# EAGLE design board (EAGLE 9.0.0)
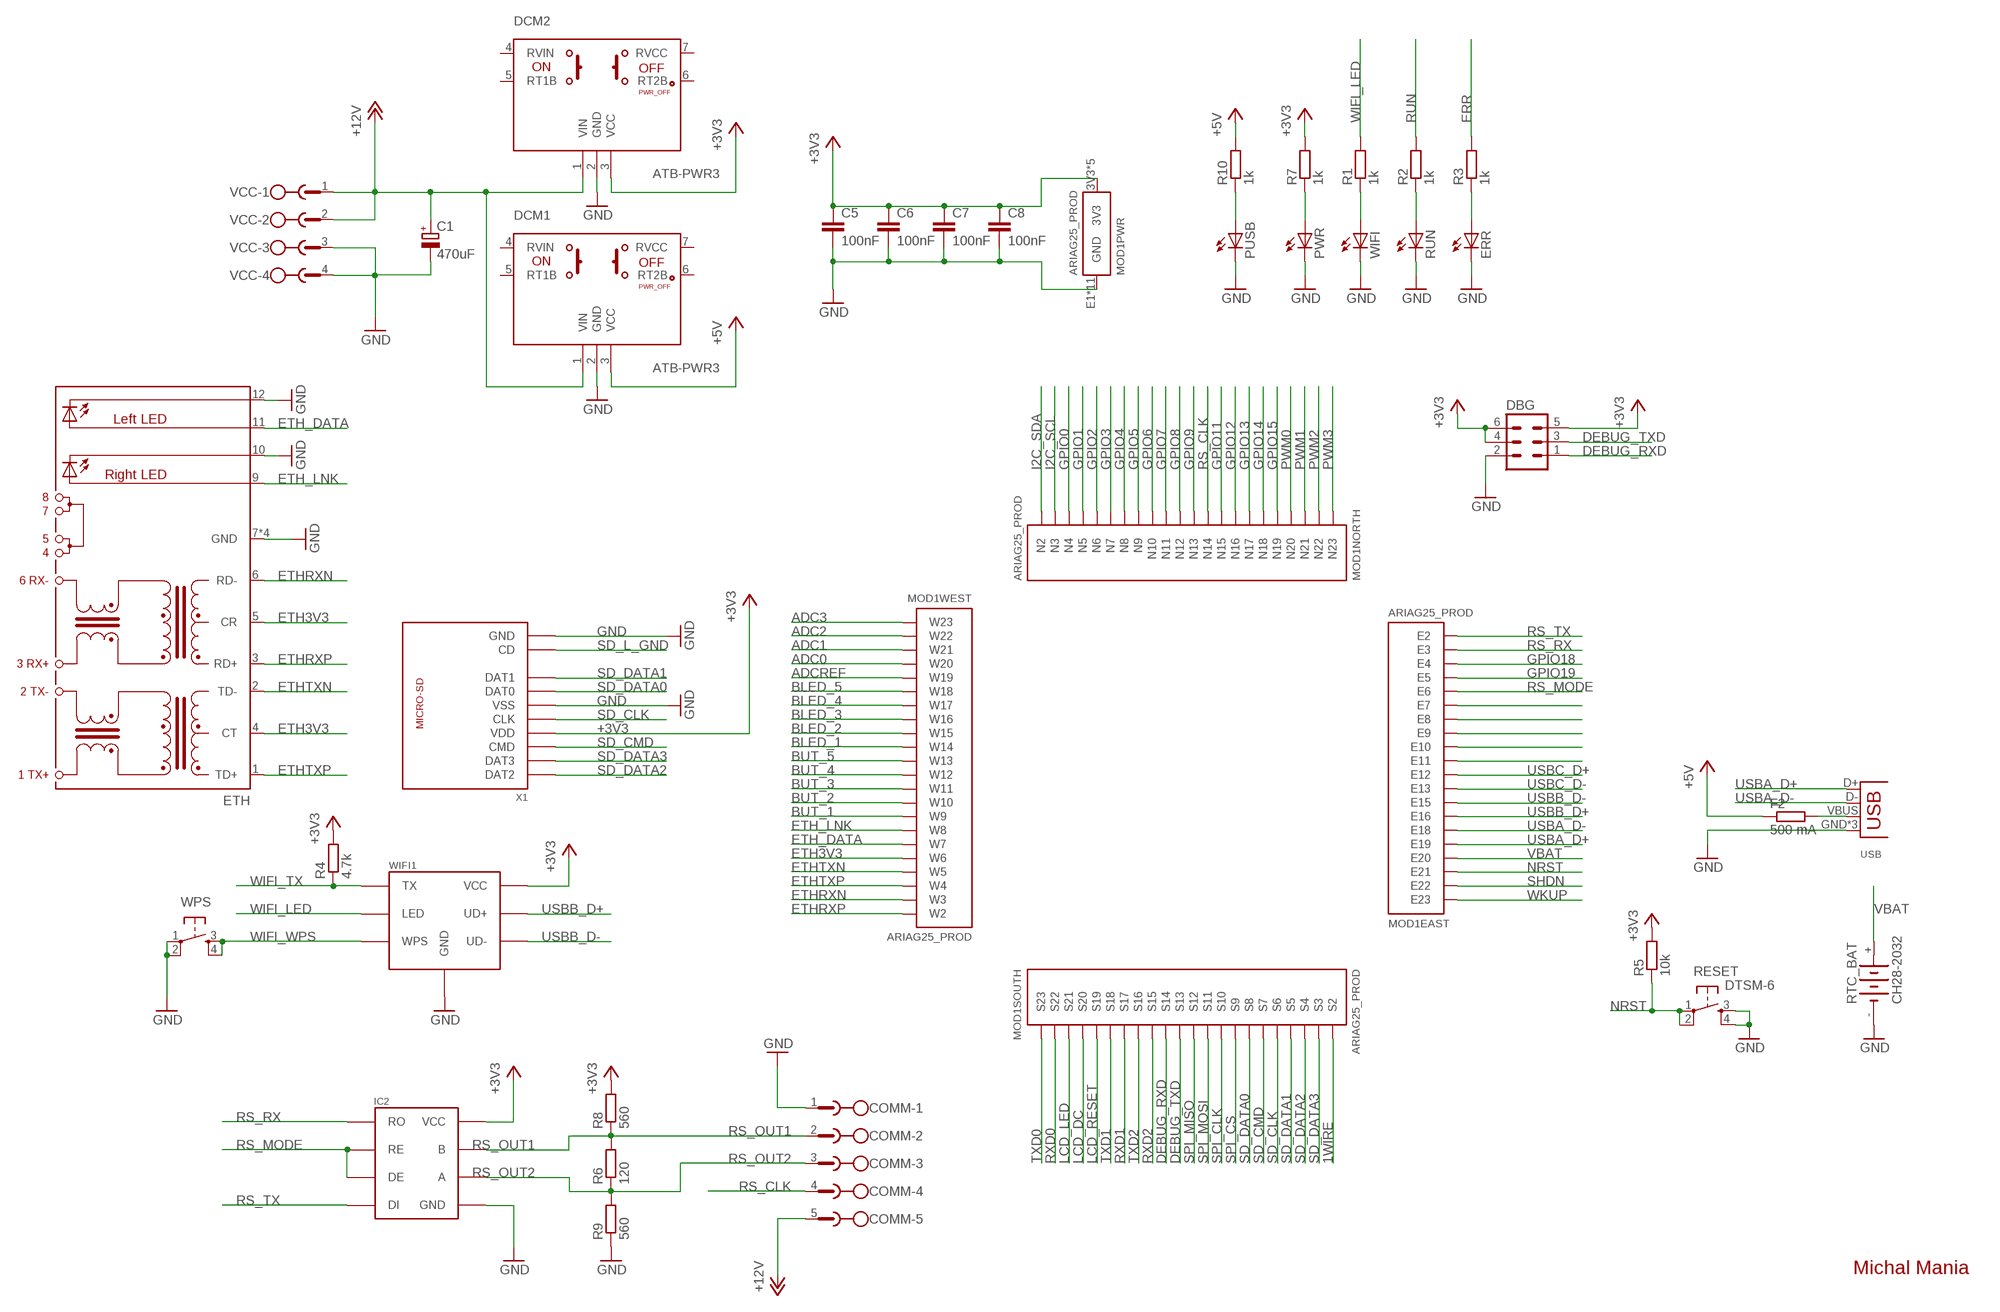
[diagram p0: schematic, sheet 1]

## Parts
C1  470uF  CPOL-EUG  [PANASONIC_G]
C5  100nF  C-EUC0805  [C0805]
C6  100nF  C-EUC0805  [C0805]
C7  100nF  C-EUC0805  [C0805]
C8  100nF  C-EUC0805  [C0805]
COMM  MSTBV5  [MSTBV5]
DBG  MA03-2  [MA03-2]
DCM1  ATB-PWR3  [ATB-PWR3]
DCM2  ATB-PWR3  [ATB-PWR3]
ERR  LEDSML0805  [SML0805]
ETH  J21388  [J1_3_TOP]
F2  500 mA  R-EU_R0805  [R0805]
IC2  MAX3485  [SO-8]
MOD1  ARIAG25_PROD  [G25_D]
PUSB  LEDSML0805  [SML0805]
PWR  LEDSML0805  [SML0805]
R1  1k  R-EU_R0805  [R0805]
R2  1k  R-EU_R0805  [R0805]
R3  1k  R-EU_R0805  [R0805]
R4  4.7k  R-EU_R0805  [R0805]
R5  10k  R-EU_R0805  [R0805]
R6  120  R-EU_R0805  [R0805]
R7  1k  R-EU_R0805  [R0805]
R8  560  R-EU_R0805  [R0805]
R9  560  R-EU_R0805  [R0805]
R10  1k  R-EU_R0805  [R0805]
RESET  DTSM-6  [DTSM-6]
RTC_BAT  CH28-2032  [CH28-2032]
RUN  LEDSML0805  [SML0805]
USB  USBA-P  [USB-A-P]
VCC  MSTBV4  [MSTBV4]
WIFI  LEDSML0805  [SML0805]
WIFI1  WIFI-2-OEM  [WIFI]
WPS  DTSM-6  [DTSM-6]
X1  MICRO-SD  [112I-TDAR-R]

## Nets
1WIRE: MOD1.S2(SOUTH:S2)
+3V3: C5.1 C6.1 C7.1 C8.1 DBG.4 DBG.5 DBG.6 DCM2.3(VCC) IC2.VCC MOD1.3V3(PWR:3V3) MOD1.E24(PWR:3V3) MOD1.N1(PWR:3V3) MOD1.S1(PWR:3V3) MOD1.W24(PWR:3V3) R4.2 R5.2 R7.2 R8.2 WIFI1.VCC X1.4(VDD)
+5V: DCM1.3(VCC) F2.1 R10.2
+12V: C1.+ COMM.5 DCM1.1(VIN) DCM2.1(VIN) VCC.1 VCC.2
ADC0: MOD1.W20(WEST:W20)
ADC1: MOD1.W21(WEST:W21)
ADC2: MOD1.W22(WEST:W22)
ADC3: MOD1.W23(WEST:W23)
ADCREF: MOD1.W19(WEST:W19)
BLED_1: MOD1.W14(WEST:W14)
BLED_2: MOD1.W15(WEST:W15)
BLED_3: MOD1.W16(WEST:W16)
BLED_4: MOD1.W17(WEST:W17)
BLED_5: MOD1.W18(WEST:W18)
BUT_1: MOD1.W9(WEST:W9)
BUT_2: MOD1.W10(WEST:W10)
BUT_3: MOD1.W11(WEST:W11)
BUT_4: MOD1.W12(WEST:W12)
BUT_5: MOD1.W13(WEST:W13)
DEBUG_RXD: DBG.1 MOD1.S14(SOUTH:S14)
DEBUG_TXD: DBG.3 MOD1.S13(SOUTH:S13)
ERR: R3.2
ETH3V3: ETH.4(CT) ETH.5(CR) MOD1.W6(WEST:W6)
ETH_DATA: ETH.11(L+) MOD1.W7(WEST:W7)
ETH_LNK: ETH.9(R+) MOD1.W8(WEST:W8)
ETHRXN: ETH.6(RD-) MOD1.W3(WEST:W3)
ETHRXP: ETH.3(RD+) MOD1.W2(WEST:W2)
ETHTXN: ETH.2(TD-) MOD1.W5(WEST:W5)
ETHTXP: ETH.1(TD+) MOD1.W4(WEST:W4)
GND: C1.- C5.2 C6.2 C7.2 C8.2 COMM.1 DBG.2 DCM1.2(GND) DCM2.2(GND) ERR.C ETH.7(GND) ETH.8(GND) ETH.10(R-) ETH.12(L-) ETH.M1(GND) ETH.M2(GND) IC2.GND MOD1.E1(PWR:GND) MOD1.E14(PWR:GND) MOD1.E17(PWR:GND) MOD1.GND@1(PWR:GND) MOD1.GND@2(PWR:GND) MOD1.GND@3(PWR:GND) MOD1.GND@4(PWR:GND) MOD1.GND@5(PWR:GND) MOD1.N24(PWR:GND) MOD1.S24(PWR:GND) MOD1.W1(PWR:GND) PUSB.C PWR.C R9.1 RESET.3 RESET.4 RTC_BAT.- RUN.C USB.GND USB.P$5(GND) USB.P$6(GND) VCC.3 VCC.4 WIFI1.GND WIFI.C WPS.1 WPS.2 X1.6(VSS) X1.GND_A(GND) X1.GND_B(GND) X1.GND_C(GND)
GPIO0: MOD1.N4(NORTH:N4)
GPIO1: MOD1.N5(NORTH:N5)
GPIO2: MOD1.N6(NORTH:N6)
GPIO3: MOD1.N7(NORTH:N7)
GPIO4: MOD1.N8(NORTH:N8)
GPIO5: MOD1.N9(NORTH:N9)
GPIO6: MOD1.N10(NORTH:N10)
GPIO7: MOD1.N11(NORTH:N11)
GPIO8: MOD1.N12(NORTH:N12)
GPIO9: MOD1.N13(NORTH:N13)
GPIO11: MOD1.N15(NORTH:N15)
GPIO12: MOD1.N16(NORTH:N16)
GPIO13: MOD1.N17(NORTH:N17)
GPIO14: MOD1.N18(NORTH:N18)
GPIO15: MOD1.N19(NORTH:N19)
GPIO18: MOD1.E4(EAST:E4)
GPIO19: MOD1.E5(EAST:E5)
I2C_SCL: MOD1.N3(NORTH:N3)
I2C_SDA: MOD1.N2(NORTH:N2)
LCD_DC: MOD1.S20(SOUTH:S20)
LCD_LED: MOD1.S21(SOUTH:S21)
LCD_RESET: MOD1.S19(SOUTH:S19)
N$1: R1.1 WIFI.A
N$2: F2.2 USB.VBUS
N$3: MOD1.E11(EAST:E11)
N$5: R2.1 RUN.A
N$6: ERR.A R3.1
N$7: PWR.A R7.1
N$8: PUSB.A R10.1
N$11: MOD1.E7(EAST:E7)
N$12: MOD1.E8(EAST:E8)
N$13: MOD1.E9(EAST:E9)
N$14: MOD1.E10(EAST:E10)
NRST: MOD1.E21(EAST:E21) R5.1 RESET.1 RESET.2
PWM0: MOD1.N20(NORTH:N20)
PWM1: MOD1.N21(NORTH:N21)
PWM2: MOD1.N22(NORTH:N22)
PWM3: MOD1.N23(NORTH:N23)
RS_CLK: COMM.4 MOD1.N14(NORTH:N14)
RS_MODE: IC2.DE IC2.RE MOD1.E6(EAST:E6)
RS_OUT1: COMM.2 IC2.B R6.2 R8.1
RS_OUT2: COMM.3 IC2.A R6.1 R9.2
RS_RX: IC2.RO MOD1.E3(EAST:E3)
RS_TX: IC2.DI MOD1.E2(EAST:E2)
RUN: R2.2
RXD0: MOD1.S22(SOUTH:S22)
RXD1: MOD1.S17(SOUTH:S17)
RXD2: MOD1.S15(SOUTH:S15)
SD_CLK: MOD1.S6(SOUTH:S6) X1.5(CLK)
SD_CMD: MOD1.S7(SOUTH:S7) X1.3(CMD)
SD_DATA0: MOD1.S8(SOUTH:S8) X1.7(DAT0)
SD_DATA1: MOD1.S5(SOUTH:S5) X1.8(DAT1)
SD_DATA2: MOD1.S4(SOUTH:S4) X1.1(DAT2)
SD_DATA3: MOD1.S3(SOUTH:S3) X1.2(DAT3)
SD_L_GND: X1.CD
SHDN: MOD1.E22(EAST:E22)
SPI_CLK: MOD1.S10(SOUTH:S10)
SPI_CS: MOD1.S9(SOUTH:S9)
SPI_MISO: MOD1.S12(SOUTH:S12)
SPI_MOSI: MOD1.S11(SOUTH:S11)
TXD0: MOD1.S23(SOUTH:S23)
TXD1: MOD1.S18(SOUTH:S18)
TXD2: MOD1.S16(SOUTH:S16)
USBA_D+: MOD1.E19(EAST:E19) USB.D+
USBA_D-: MOD1.E18(EAST:E18) USB.D-
USBB_D+: MOD1.E16(EAST:E16) WIFI1.UD+
USBB_D-: MOD1.E15(EAST:E15) WIFI1.UD-
USBC_D+: MOD1.E12(EAST:E12)
USBC_D-: MOD1.E13(EAST:E13)
VBAT: MOD1.E20(EAST:E20) RTC_BAT.+
WIFI_LED: R1.2 WIFI1.LED
WIFI_TX: R4.1 WIFI1.TX
WIFI_WPS: WIFI1.WPS WPS.3 WPS.4
WKUP: MOD1.E23(EAST:E23)
Unconnected: DCM1.4(RVIN) DCM1.5(RT1B) DCM1.6(RT2B) DCM1.7(RVCC) DCM2.4(RVIN) DCM2.5(RT1B) DCM2.6(RT2B) DCM2.7(RVCC)

## Notes on the sheet
- Michal Mania

## Library data of the parts
C1 = rcl:CPOL-EU: POLARIZED CAPACITOR, European symbol
C5-C8 = rcl:C-EU: CAPACITOR, European symbol
COMM = con-phoenix-508:MSTBV5: PHOENIX; MPN: MSTBV 2,5/5-GF-5.08; OC_FARNELL: 1792795; OC_NEWARK: 69R9848
DBG = con-lstb:MA03-2: PIN HEADER; OC_FARNELL: unknown; OC_NEWARK: unknown
DCM1 DCM2 = _ATNEL:ATB-PWR3
ERR PUSB PWR RUN WIFI = led:LED: LED OSRAM: - CHIPLED LG R971, LG N971, LY N971, LG Q971, LY Q971, LO R971, LY R971 LH N974, LH R974 LS Q976, LO Q976, LY Q976 LO Q996 - Hyper CHIPLED LW Q18S LB Q993, LB Q99A, LB R99A - SideLED LS A670, LO A670, LY A670, LG A670, LP A670 LB A673, LV A673, LT A673, LW A673 LH A674 LY A675 LS A676, LA A676, LO A676, LY A676, LW A676 LS A679, LY A679, LG A679 - Hyper Micro SIDELED® LS Y876, LA Y876, LO Y876, LY Y876 LT Y87S - SmartLED LW L88C, LW L88S LB L89C, LB L89S, LG L890 LS L89K, LO L89K, LY L89K LS L896, LA L896, LO L896, LY L896 - TOPLED LS T670, LO T670, LY T670, LG T670, LP T670 LSG T670, LSP T670, LSY T670, LOP T670, LYG T670 LG T671, LOG T671, LSG T671 LB T673, LV T673, LT T673, LW T673 LH T674 LS T676, LA T676, LO T676, LY T676, LB T676, LH T676, LSB T676, LW T676 LB T67C, LV T67C, LT T67C, LS T67K, LO T67K, LY T67K, LW E67C LS E67B, LA E67B, LO E67B, LY E67B, LB E67C, LV E67C, LT E67C LW T67C LS T679, LY T679, LG T679 LS T770, LO T770, LY T770, LG T770, LP T770 LB T773, LV T773, LT T773, LW T773 LH T774 LS E675, LA E675, LY E675, LS T675 LS T776, LA T776, LO T776, LY T776, LB T776 LHGB T686 LT T68C, LB T68C - Hyper Mini TOPLED® LB M676 - Mini TOPLED Santana® LG M470 LS M47K, LO M47K, LY M47K Source: http://www.osram.convergy.de LUXEON: - LUMILED® LXK2-PW12-R00, LXK2-PW12-S00, LXK2-PW14-U00, LXK2-PW14-V00 LXK2-PM12-R00, LXK2-PM12-S00, LXK2-PM14-U00 LXK2-PE12-Q00, LXK2-PE12-R00, LXK2-PE12-S00, LXK2-PE14-T00, LXK2-PE14-U00 LXK2-PB12-K00, LXK2-PB12-L00, LXK2-PB12-M00, LXK2-PB14-N00, LXK2-PB14-P00, LXK2-PB14-Q00 LXK2-PR12-L00, LXK2-PR12-M00, LXK2-PR14-Q00, LXK2-PR14-R00 LXK2-PD12-Q00, LXK2-PD12-R00, LXK2-PD12-S00 LXK2-PH12-R00, LXK2-PH12-S00 LXK2-PL12-P00, LXK2-PL12-Q00, LXK2-PL12-R00 Source: www.luxeon.com KINGBRIGHT: KA-3528ASYC Source: www.kingbright.com
ETH = con-pulse:J21388
F2 R1-R10 = resistor:R-EU_: RESISTOR, European symbol
IC2 = MAX3485ESA:MAX3485
MOD1 = ariag25_pelicella:ARIAG25_PROD: Aria G25 - Low cost Linux Embedded SMD module ISTRUZIONI PER IL MONTAGGIO Per il telaio serigrafico lo spessore è 120 micron così si possono montare componenti anche piccoli come gli 0402 vicino all'Aria. Per il montaggio automatico delle Aria: Additional Z move durante il piazzamento: 0.5mm (utile per spingere l'Aria sulla carrier in modo che si adatti a tocchi tutte le PAD con lo stagno. (l'additional Z move infatti è assorbito dalle molle della testa automatica) Tempo di piazzamento: 5 seconds (necessario per permettere all'Aria di toccare perfettamente tutte le PAD stagnate) Altezza Z dell'Aria: 2.7mm Montare le Aria a bassa velocità totale.
RESET WPS = switch-tact:DTSM-6
RTC_BAT = battery:CH28-2032
USB = con-usb-3:USB: USB Connectors
VCC = con-phoenix-508:MSTBV4: PHOENIX; MPN: MSTBV 2,5/4-GF-5.08; OC_FARNELL: 1792794; OC_NEWARK: 69R9847
WIFI1 = WIFI-2-OEM:WIFI-2-OEM
X1 = con-attend:MICRO-SD

## Board
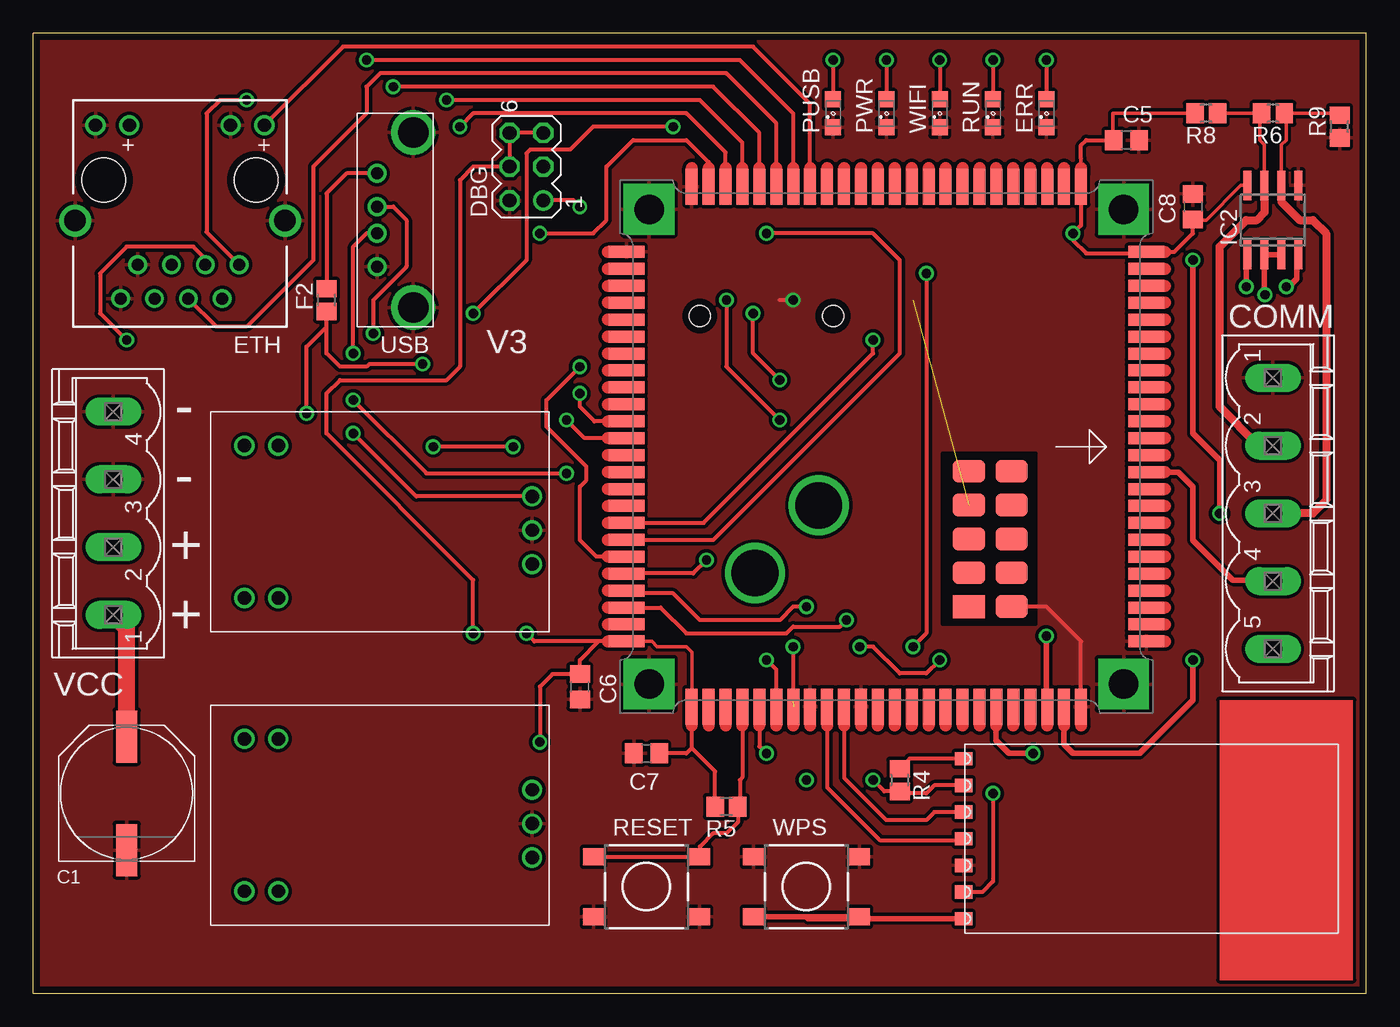
[diagram p1: board, top side]
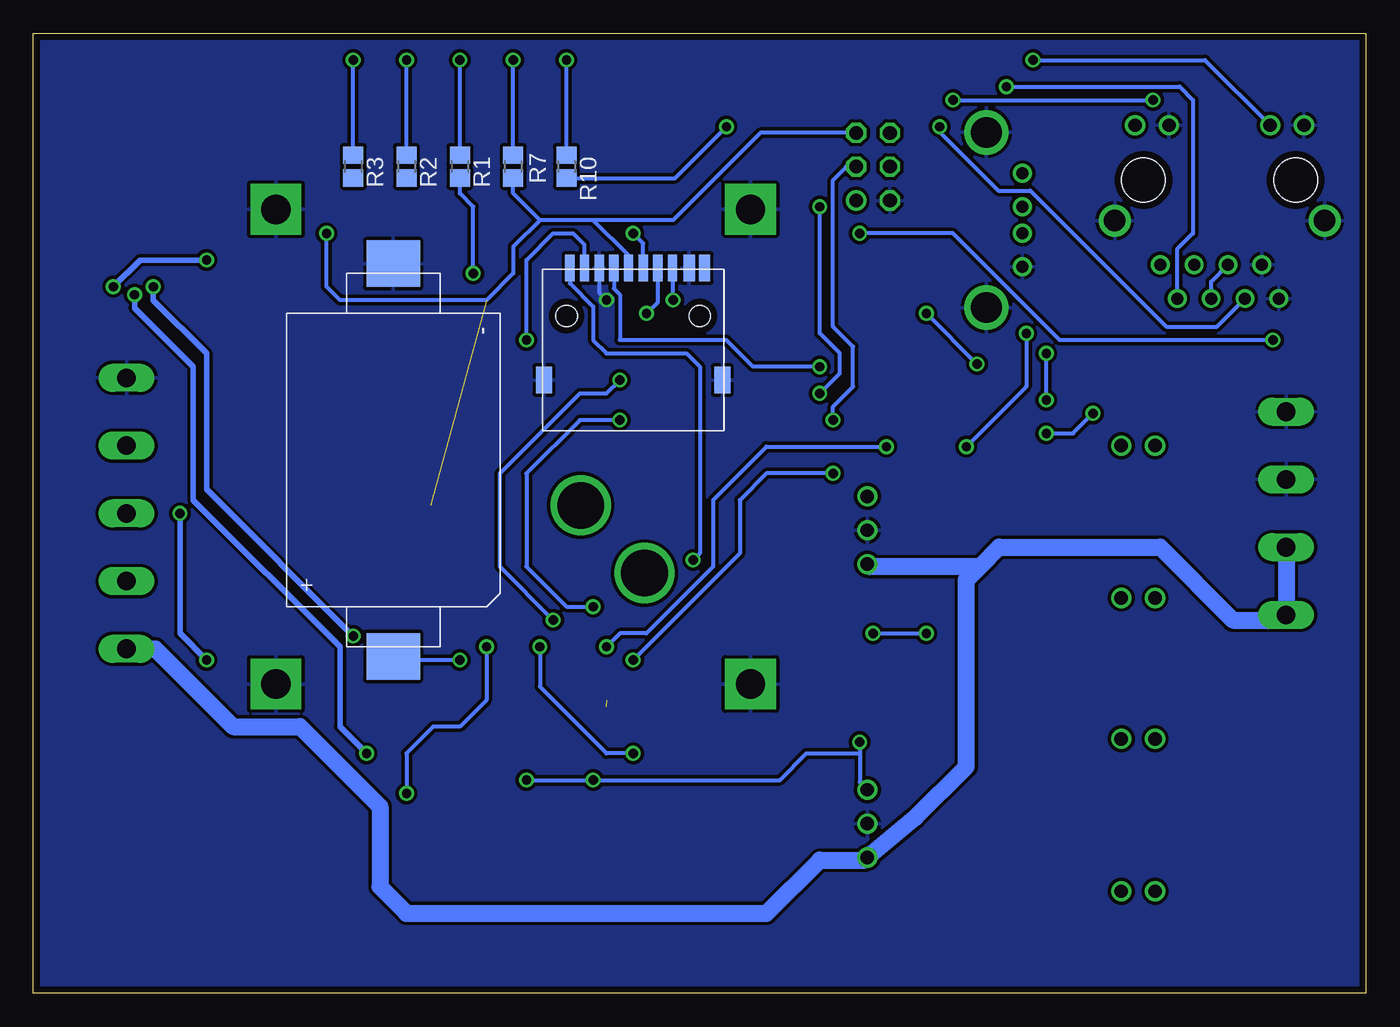
[diagram p2: board, bottom side, seen from below]

Size 100 x 72 mm. Coordinates in mm from the lower left corner, seen from the top.
Outline: 0,0 100,0 100,72 0,72 0,0
Copper layers (1*16): Top 0.035mm / dielectric 1.5mm / Bottom 0.035mm
Design rules "default *": minimum track width 10mil, minimum drill 24mil, track to track 10mil, track to pad 10mil, pad to pad 10mil, via to via 10mil, smd to smd 10mil, copper to edge 20mil, drill to drill 10mil, minimum pad ring 10mil, minimum via ring 8mil, stop-mask expansion 4mil, vias tented up to drill 0mil, thermal gap 10mil
tKeepout: area 0,69 to 100,72; area 0,0 to 100,3
bKeepout: area 0,66 to 100,72; area 0,0 to 100,6

### Footprints (pad centres in the part's own frame; a part is rotated, then mirrored left to right if it is on the bottom)
PANASONIC_G = smd 3.9 x 1.6: + 4.25,0; - -4.25,0
C0805 = smd 1.3 x 1.5: 1 -0.95,0; 2 0.95,0
MSTBV5 = drill 1.397 long: 1 -10.16,0; 2 -5.08,0; 3 0,0; 4 5.08,0; 5 10.16,0
MA03-2 = drill 1.016: 1 -2.54,-1.27 | drill 1.016 octagon: 2 -2.54,1.27; 3 0,-1.27; 4 0,1.27; 5 2.54,-1.27; 6 2.54,1.27
ATB-PWR3 = drill 1: 1 11.43,-3.81; 2 11.43,-1.27; 3 11.43,1.27; 4 -7.62,-6.35; 5 -10.16,-6.35; 6 -10.16,5.08; 7 -7.62,5.08
SML0805 = smd 1.2 x 1.2: A 1.05,0; C -1.05,0
J1_3_TOP = drill 0.9 pad 1.3: 1 4.445,-4.35; 2 3.175,-6.89; 3 1.905,-4.35; 4 0.635,-6.89; 5 -0.635,-4.35; 6 -1.905,-6.89; 7 -3.175,-4.35; 8 -4.445,-6.89 | drill 1 pad 1.422: 9 6.335,6.11; 10 3.795,6.11; 11 -3.795,6.11; 12 -6.335,6.11 | drill 1.6 pad 2.184: M1 7.875,-1.05; M2 -7.875,-1.05 | hole 3.3: -5.715,2; 5.715,2
R0805 = smd 1.3 x 1.5: 1 -0.85,0; 2 0.85,0
SO-8 = smd 2.2 x 0.6: A 2.6,-0.635; B 2.6,0.635; DE -2.6,-0.635; DI -2.6,-1.905; GND 2.6,-1.905; RE -2.6,0.635; RO -2.6,1.905; VCC 2.6,1.905
G25_D = smd 1.7 x 2.4: 3V3 4.38,6.2; GND@5 12,9.4; P$2 9.46,9.4; P$3 6.92,9.4; P$4 4.38,9.4; P$5 1.84,9.4; P$6 12,6.2; P$7 9.46,6.2; P$8 6.92,6.2; P$10 1.84,6.2 | smd 2.7 x 0.9: E1 19.5,14.605; E2 19.5,13.335; E3 19.5,12.065; E4 19.5,10.795; E5 19.5,9.525; E6 19.5,8.255; E7 19.5,6.985; E8 19.5,5.715; E9 19.5,4.445; E10 19.5,3.175; E11 19.5,1.905; E12 19.5,0.635; E13 19.5,-0.635; E14 19.5,-1.905; E15 19.5,-3.175; E16 19.5,-4.445; E17 19.5,-5.715; E18 19.5,-6.985; E19 19.5,-8.255; E20 19.5,-9.525; E21 19.5,-10.795; E22 19.5,-12.065; E23 19.5,-13.335; E24 19.5,-14.605; W1 -19.5,-14.605; W2 -19.5,-13.335; W3 -19.5,-12.065; W4 -19.5,-10.795; W5 -19.5,-9.525; W6 -19.5,-8.255; W7 -19.5,-6.985; W8 -19.5,-5.715; W9 -19.5,-4.445; W10 -19.5,-3.175; W11 -19.5,-1.905; W12 -19.5,-0.635; W13 -19.5,0.635; W14 -19.5,1.905; W15 -19.5,3.175; W16 -19.5,4.445; W17 -19.5,5.715; W18 -19.5,6.985; W19 -19.5,8.255; W20 -19.5,9.525; W21 -19.5,10.795; W22 -19.5,12.065; W23 -19.5,13.335; W24 -19.5,14.605 | drill 2.2 pad 3.81 square: GND@1 -17.8,17.8; GND@2 17.8,17.8; GND@3 17.8,-17.8; GND@4 -17.8,-17.8 | smd 0.9 x 2.7: N1 -14.605,19.5; N2 -13.335,19.5; N3 -12.065,19.5; N4 -10.795,19.5; N5 -9.525,19.5; N6 -8.255,19.5; N7 -6.985,19.5; N8 -5.715,19.5; N9 -4.445,19.5; N10 -3.175,19.5; N11 -1.905,19.5; N12 -0.635,19.5; N13 0.635,19.5; N14 1.905,19.5; N15 3.175,19.5; N16 4.445,19.5; N17 5.715,19.5; N18 6.985,19.5; N19 8.255,19.5; N20 9.525,19.5; N21 10.795,19.5; N22 12.065,19.5; N23 13.335,19.5; N24 14.605,19.5; S1 14.605,-19.5; S2 13.335,-19.5; S3 12.065,-19.5; S4 10.795,-19.5; S5 9.525,-19.5; S6 8.255,-19.5; S7 6.985,-19.5; S8 5.715,-19.5; S9 4.445,-19.5; S10 3.175,-19.5; S11 1.905,-19.5; S12 0.635,-19.5; S13 -0.635,-19.5; S14 -1.905,-19.5; S15 -3.175,-19.5; S16 -4.445,-19.5; S17 -5.715,-19.5; S18 -6.985,-19.5; S19 -8.255,-19.5; S20 -9.525,-19.5; S21 -10.795,-19.5; S22 -12.065,-19.5; S23 -13.335,-19.5; S24 -14.605,-19.5 | drill 3.5 pad 3.8: P$15 9.48,-9.86; P$16 4.4,-5.07
DTSM-6 = smd 1.55 x 1.3: 1 -3.975,2.25; 2 3.975,2.25; 3 -3.975,-2.25; 4 3.975,-2.25
CH28-2032 = smd 3.5 x 4: + 14.73,0; - -14.73,0
USB-A-P = drill 0.9: D+ -1,4.21; D- 1,4.21; GND -3.5,4.21; VBUS 3.5,4.21 | drill 2.3: P$5 -6.57,1.5; P$6 6.57,1.5
MSTBV4 = drill 1.397 long: 1 -7.62,0; 2 -2.54,0; 3 2.54,0; 4 7.62,0
WIFI = smd 1.3 x 1: GND -14.2,-2.4; LED -14.2,-4.4; TX -14.2,5.6; UD+ -14.2,-0.4; UD- -14.2,1.6; VCC -14.2,3.6; WPS -14.2,-6.4
112I-TDAR-R = smd 0.7 x 2: 1 2.95,3.4; 2 1.85,3.4; 3 0.75,3.4; 4 -0.35,3.4; 5 -1.45,3.4; 6 -2.55,3.4; 7 -3.65,3.4; 8 -4.75,3.4 | smd 0.85 x 2: CD 5.35,3.4; GND_C 4.2,3.4 | smd 1.2 x 2: GND_A -6.7,-5; GND_B 6.7,-5 | hole 1.6: -5,-0.2; 5,-0.2

### Placement (x,y rotation side)
C1  7,15 90 top
C5  82,64 0 top
C6  41,23 270 top
C7  46,18 180 top
C8  87,59 90 top
COMM  93,36 270 top
DBG  37,62 90 top
DCM1  26,36 0 top
DCM2  26,14 0 top
ERR  76,66 90 top
ETH  11,59 0 top
F2  22,52 90 top
IC2  93,58 90 top
MOD1  64,41 270 top
PUSB  60,66 90 top
PWR  64,66 90 top
R1  68,62 270 bottom
R2  72,62 270 bottom
R3  76,62 270 bottom
R4  65,16 270 top
R5  52,14 180 top
R6  93,66 180 top
R7  64,62 270 bottom
R8  88,66 180 top
R9  98,65 90 top
R10  60,62 270 bottom
RESET  46,8 0 top
RTC_BAT  73,40 270 bottom
RUN  72,66 90 top
USB  30,58 90 top
VCC  6,36 90 top
WIFI  68,66 90 top
WIFI1  84,12 0 top
WPS  58,8 0 top
X1  55,51 0 bottom

### Tracks (layer width: path | path; a pad name or v marks a point on that pad's centre or on a via)
+3V3  (via drill 0.7)  (1 unrouted)
  Top 0.254: MOD1.W24 78.61,62.6 | R8.2 81,66 81,64.05 C5.1 | IC2.VCC 90.6,60.6 88,58 87.05,58 C8.1 | 49,18 49.4,18.4 49.4,25.6 49,26 46.8,26 46.4,26.4 MOD1.S1
  Top 0.305: MOD1.E24 49.4,18.39 49,18 C7.1 | 42.4,26.39 41,25 C6.1 38.95,23.95 38,23 v38,18.84 | MOD1.S1 42.4,26.39 | C8.1 87,57 85.61,55.6 MOD1.N1 83.39,55.5 79,55.5 78,56.5 v78,57 78.61,57.6 MOD1.W24 | 78.61,62.6 78.61,63.6 79,64 C5.1 | DBG.5 DBG.6 DBG.4 33,62 32,61 32,47 31,46 23,46 22,45 22,42 33,31 v33,27 | 42.4,26.39 37.6,26.39 v37,27 | WIFI1.VCC 67.6,15.6 67,15 65.15,15 R4.2 63.85,15.15 v63,16 | R5.2 51.15,16.65 49.4,18.4
  Bottom 0.305: X1.4 55.35,55.35 58,58 | v37,27 v33,27 | v63,16 v58,16 44,16 42,18 38,18 | DBG.5 45.46,64.54 52,58 58,58 | 62,58 64,56 64,54 66,52 77,52 78,53 v78,57 | v38,18.84 38,18 | 38,18 38,15.84 DCM2.3 | 58,58 62,58 | 62,58 64,60 R7.2
+5V  (via drill 0.7)
  Top 0.305: DCM1.3 28.73,37.27 v24,42 | v20.5,43.5 20.5,48.5 22,50 | 22,50 F2.1 | v48,65 42,65 40.3,63.3 37.3,63.3 37,63 37,55 v33,51 | v29.2,47.2 25.2,47.2 25,47 23,47 22,48 22,50
  Bottom 0.305: v24,42 22,42 v20.5,43.5 | R10.2 51.85,61.15 v48,65 | v33,51 v29.2,47.2
+12V
  Top 1.27: C1.+ 7,27.38 VCC.1
  Bottom 1.27: 29,32 27.54,33.46 15.46,33.46 10,28 6.38,28 VCC.1 VCC.2 | 29,32 37.24,32 DCM1.1 | 29,32 30,31 30,17 33.81,13.19 DCM2.1 37.62,10 41,10 45,6 72,6 74,8 74,14 80,20 85,20 90.84,25.84 COMM.5
DEBUG_RXD  (via drill 0.7)
  Top 0.305: MOD1.S14 42.09,42.91 41,44 v41,45 | v41,59 40.5,59.5 38.31,59.5 DBG.1
  Bottom 0.305: v41,45 39.5,46.5 39.5,48 41,49.5 v41,59
DEBUG_TXD  (via drill 0.7)
  Top 0.305: MOD1.S13 41.37,41.63 v40,43
  Bottom 0.305: DBG.3 39,62 40,61 40,50 38.5,48.5 38.5,45.5 40,44 v40,43
ETH3V3
  Top 0.305: MOD1.W6 55.74,65.25 52,69 26,69 25,68 25,66 21,62 21,55 16,50 13.74,50 ETH.4
  Bottom 0.305: ETH.4 11.63,53.38 ETH.5
ETH_DATA  (via drill 0.7)
  Top 0.305: v25,70 53,70 57,66 57,60.52 MOD1.W7
  Bottom 0.305: v25,70 12.1,70 ETH.11
ETH_LNK
  Top 0.305: ETH.9 23.23,71 54,71 58.28,66.72 MOD1.W8
ETHRXN  (via drill 0.7)
  Top 0.305: MOD1.W3 51.94,63.06 49,66 33,66 v32,65
  Bottom 0.305: v32,65 32,64.6 27.6,60.2 25.2,60.2 15,50 11.21,50 ETH.6
ETHRXP  (via drill 0.7)
  Top 0.305: ETH.3 12.9,55.09 12,56 7,56 5,54 5,51 v7,49 | v38,57 42,57 43,58 43,62 45,64 49,64 50.66,62.34 MOD1.W2
  Bottom 0.305: v7,49 23,49 31,57 v38,57
ETHTXN  (via drill 0.7)
  Top 0.305: MOD1.W5 54.48,64.53 51,68 v27,68
  Bottom 0.305: v27,68 14,68 13,67 13,57 14.2,55.8 14.2,52.13 ETH.2
ETHTXP  (via drill 0.7)
  Top 0.305: MOD1.W4 53.2,63.8 50,67 v31,67 | v16,67 14,67 13,66 13,57.09 ETH.1
  Bottom 0.305: v31,67 v16,67
GND  (via drill 0.7)
  Top 0.305: MOD1.E1 78.61,26.39 76,29 MOD1.GND@5 | v57,52 56,52
  Bottom 0.305: X1.6 57.55,52.55 v57,52
  pour Top: 0,72 100,72 100,0 0,0
  pour Bottom: 0,72 100,72 100,0 0,0
N$1  (via drill 0.7)
  Top 0.305: v68,70 WIFI.A
  Bottom 0.305: R1.1 v68,70
N$2
  Top 0.305: USB.VBUS 23.5,61.5 22,60 F2.2
N$4
  cutout Top: 68.2,40.5 75.2,40.5 75.2,27.7 68.2,27.7
N$5  (via drill 0.7)
  Top 0.305: v72,70 RUN.A
  Bottom 0.305: R2.1 v72,70
N$6  (via drill 0.7)
  Top 0.305: v76,70 ERR.A
  Bottom 0.305: R3.1 v76,70
N$7  (via drill 0.7)
  Top 0.305: v64,70 PWR.A
  Bottom 0.305: R7.1 v64,70
N$8  (via drill 0.7)
  Top 0.305: v60,70 PUSB.A
  Bottom 0.305: R10.1 v60,70
NRST
  Top 0.305: RESET.1 RESET.2 50,10.28 50,11 51,12 52,12 52.85,12.85 R5.1 53,14.15 53,16 53.2,16.2 MOD1.E21
RS_CLK
  Top 0.406: MOD1.N14 85.91,39.09 87,38 87,34 90,31 92.92,31 COMM.4
RS_MODE  (via drill 0.7)
  Top 0.254: 72,21 72.3,21.3 72.3,21.45 MOD1.E6
  Top 0.406: IC2.DE IC2.RE 92.36,52.44 v92.4,52.4 | v75,18 73.2,18 72.2,19 72.2,20.8 72,21
  Bottom 0.406: v75,18 77,20 77,26 88,37 88,47 92.4,51.4 v92.4,52.4
RS_OUT1
  Top 0.254: IC2.B 92.36,63.63 92,64 92,65.85 R6.2 R8.1
  Top 0.61: COMM.2 91.92,41.08 89,44 89,56 91,58 91.8,58 92.36,58.56 IC2.B
RS_OUT2
  Top 0.254: R9.2 97.85,66 R6.1 94,65.85 94,64 93.64,63.63 IC2.A
  Top 0.61: IC2.A 93.64,59.37 95,58 96,58 97,57 97,37 96,36 COMM.3
RS_RX  (via drill 0.7)
  Top 0.406: IC2.RO 91,55.4 v91,53 | v76,26.8 76,21.57 MOD1.E3
  Bottom 0.406: v91,53 91,52 87,48 87,37.8 v76,26.8
RS_TX  (via drill 0.7)
  Top 0.406: MOD1.E2 77.33,18.66 78,18 83,18 87,22 v87,25 | v94,53 94.2,53 94.8,53.6 94.8,55.3 IC2.DI | v87,55 87,42 89,40 v89,36
  Bottom 0.406: v87,55 92,55 v94,53 | v89,36 89,27 v87,25
SD_CLK  (via drill 0.7)
  Top 0.305: MOD1.S6 42.26,32.74 41,34 41,38 41.5,38.5 41.5,39.5 38.5,42.5 38.5,44.5 v41,47
  Bottom 0.305: v41,47 46,47 48,49 56,49 56,52.4 56.45,52.85 X1.5
SD_CMD  (via drill 0.7)
  Top 0.305: MOD1.S7 51.02,34.02 65,48 65,55 63,57 v55,57
  Bottom 0.305: v55,57 54.25,56.25 X1.3
SD_DATA0  (via drill 0.7)
  Top 0.305: MOD1.S8 50.28,35.28 63,48 v63,49
  Bottom 0.305: v63,49 63,55 61,57 59.5,57 58.65,56.15 X1.7
SD_DATA1  (via drill 0.7)
  Top 0.305: v50.5,32.5 49.5,31.5 44.52,31.5 MOD1.S5
  Bottom 0.305: X1.8 59.75,53.25 58,51.5 58,49 57,48 51,48 50,47 50,33 v50.5,32.5
SD_DATA2  (via drill 0.7)
  Top 0.305: v52,52 52,47 v56,43 | v58,29 57,29 56,28 50,28 48,30 44.7,30 MOD1.S4
  Bottom 0.305: X1.1 52.05,52.05 v52,52 | v56,43 59,43 63,39 63,32 60,29 v58,29
SD_DATA3  (via drill 0.7)
  Top 0.305: MOD1.S3 47.06,28.93 49,27 56.5,27 57,27.5 60.5,27.5 v61,28 | v56,46 54,48 v54,51
  Bottom 0.305: v61,28 65,32 65,39 59,45 57,45 v56,46 | v54,51 53.15,51.85 X1.2
USBA_D+  (via drill 0.7)
  Top 0.305: USB.D+ 25,57 24,56 v24,48 | v40,39 29.5,39 v24,44.5 | v55,25 55.74,24.25 MOD1.E19
  Bottom 0.305: v40,39 45,39 47,37 47,33 v55,25 | v24,44.5 v24,48
USBA_D-  (via drill 0.7)  (1 unrouted)
  Top 0.305: USB.D- 27,59 28,58 28,54.5 25.5,52 v25.5,49.5 | v57,26 57,22 | v36,41 v30,41
  Bottom 0.305: v25.5,49.5 25.5,45.5 29.5,41.5 v30,41 | v57,26 56,27 54,27 49,32 49,37 45,41 v36,41
USBB_D+
  Top 0.305: MOD1.E16 59.55,15.45 63.5,11.5 69.7,11.5 WIFI1.UD+
USBB_D-
  Top 0.305: MOD1.E15 60.83,16.18 64,13 67,13 67.6,13.6 WIFI1.UD-
VBAT  (via drill 0.7)
  Top 0.305: MOD1.E20 54.48,18.52 v55,18 | v68,25 67,24 65,24 63,26 v62,26
  Bottom 0.305: v68,25 72.73,25 RTC_BAT.+ | v55,18 57,18 62,23 v62,26
WIFI_LED  (via drill 0.7)
  Top 0.305: v67,54 67,27 v66,26 | v72,15 72,8.4 71.2,7.6 WIFI1.LED
  Bottom 0.305: v66,26 66,22 68,20 70,20 72,18 v72,15 | v67,54 67,59 68,60 R1.2
WIFI_TX
  Top 0.305: WIFI1.TX 65.75,17.6 R4.1
WIFI_WPS
  Top 0.406: WIFI1.WPS 58.12,5.6 WPS.4 WPS.3
(copper drawn outside any net)
  shapes: Top area x1

### Text on the board
tPlace: V3
tNames: - | - | + | +